# EAGLE design timer-board (EAGLE 9.6.1)
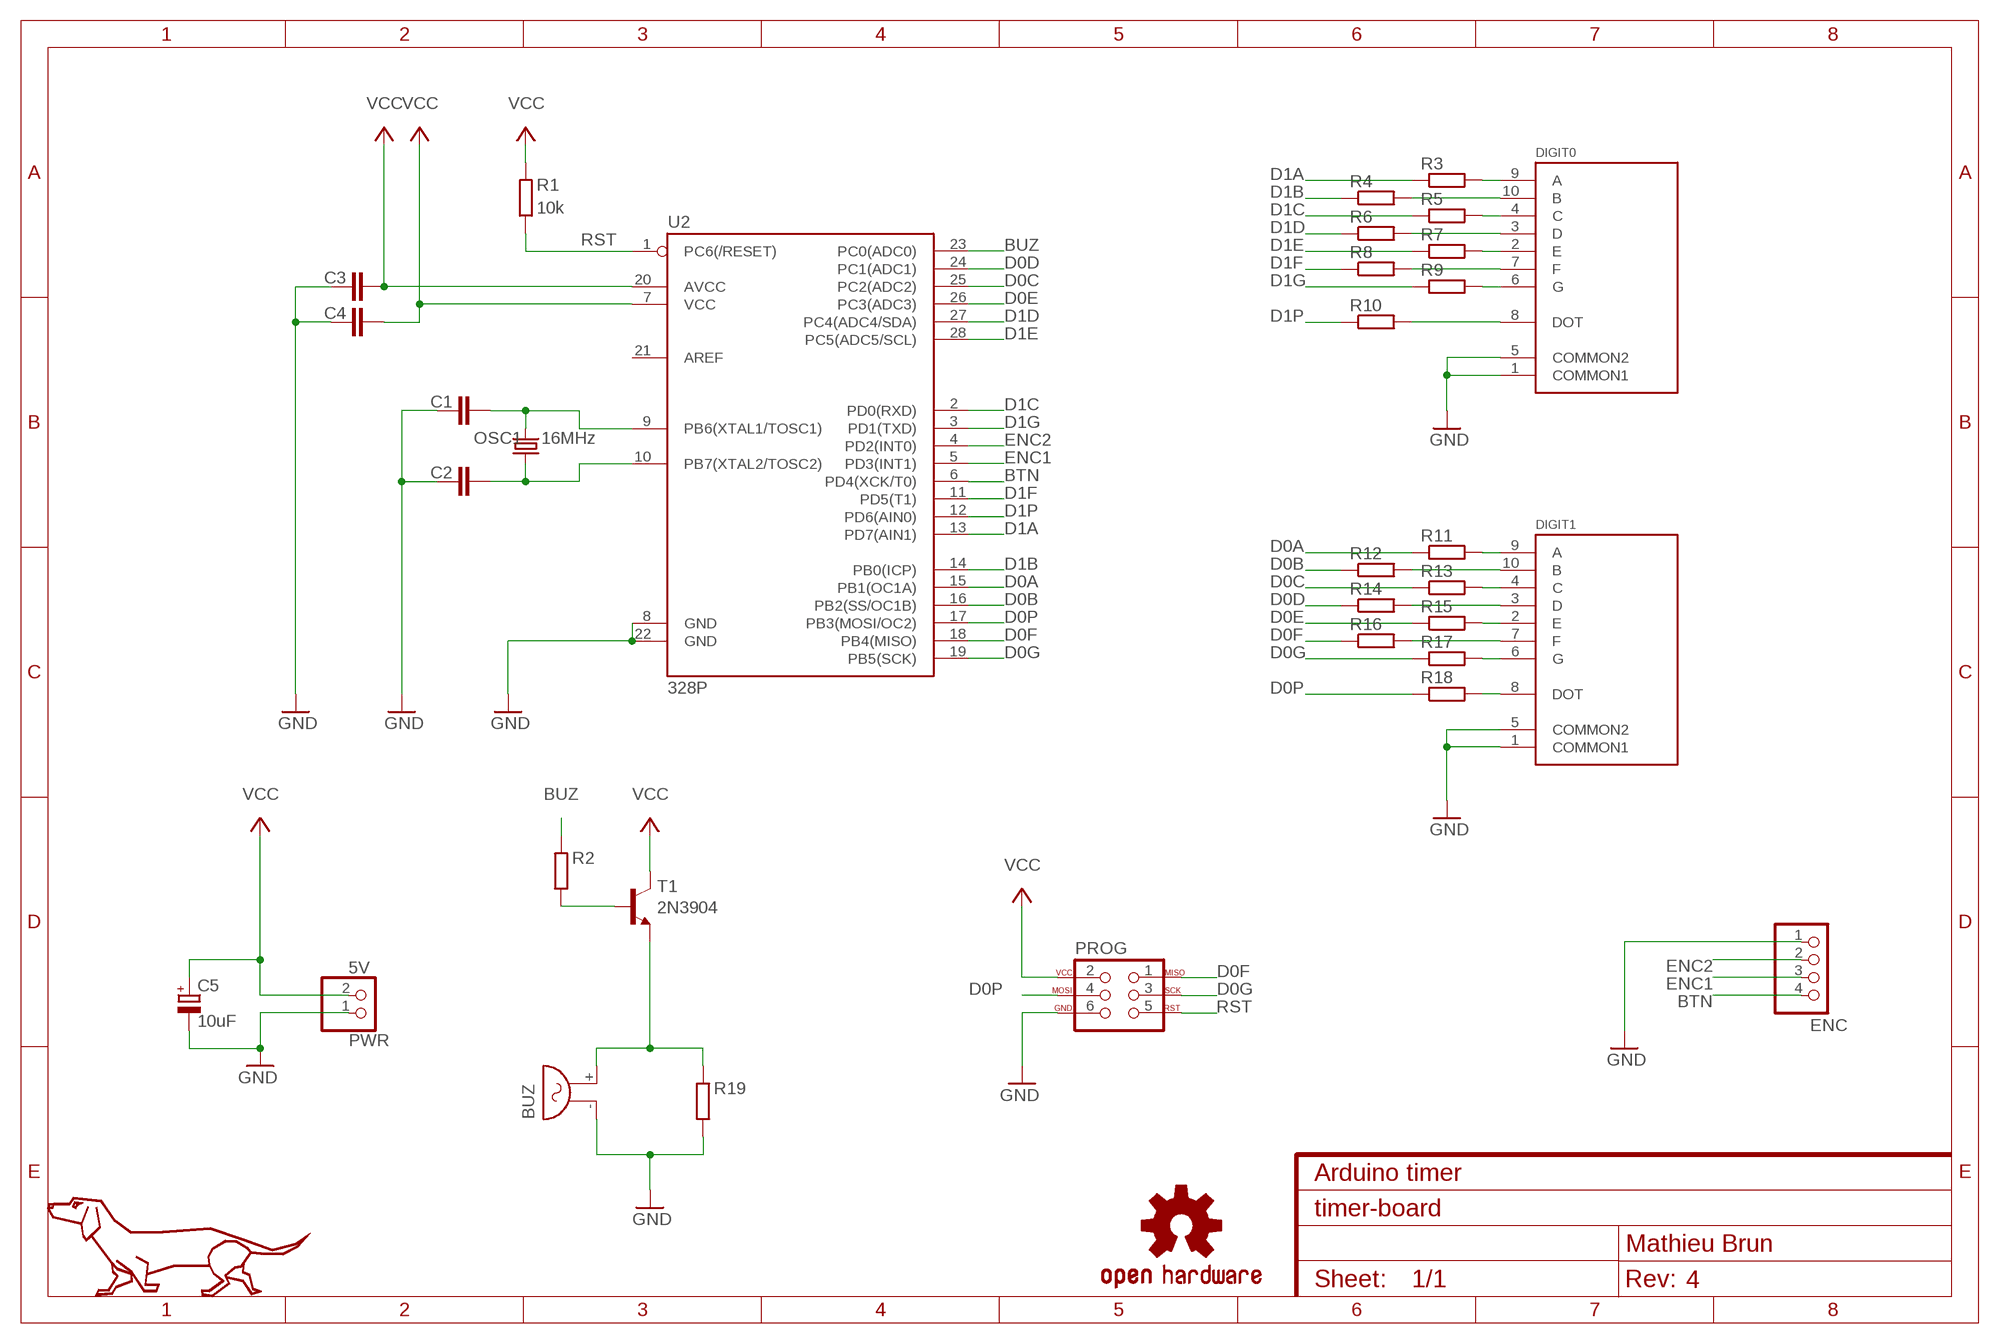
[diagram p0: schematic, sheet 1]
FRAME1 (FRAME-A4L): CNAME: Arduino timer; CREVISION: 4; DESIGNER: Mathieu Brun

## Parts
BUZ  BUZZER  [BUZZER]
C1  22pF  C-EU025-024X044  [C025-024X044]
C2  22pF  C-EU025-024X044  [C025-024X044]
C3  0.1uF  C-EU025-024X044  [C025-024X044]
C4  0.1uF  C-EU025-024X044  [C025-024X044]
C5  10uF  CPOL-EUE2.5-6  [E2,5-6]
DIGIT0  7_SEGMENT_DISPLAY  [7_SEGMENT_1.8_INCH]
DIGIT1  7_SEGMENT_DISPLAY  [7_SEGMENT_1.8_INCH]
ENC  CONN_1X5  CONN_1X4  [1X04_LOCK_JST]
LOGO1  OSHW-LOGOL  [OSHW-LOGO-L]
OSC1  16MHz  CRYSTAL-16MHZPTH-HC49US  [HC49US]
PROG  AVR_SPI_PROG_3X22X3_LOCK  [2X3_LOCK]
PWR  5V  CONN_1X2JST  [1X02_LOCK_JST]
R1  10k  R-EU_0207/10  [0207/10]
R2  R-EU_0207/10  [0207/10]
R3  R-EU_0207/10  [0207/10]
R4  R-EU_0207/10  [0207/10]
R5  R-EU_0207/10  [0207/10]
R6  R-EU_0207/10  [0207/10]
R7  R-EU_0207/10  [0207/10]
R8  R-EU_0207/10  [0207/10]
R9  R-EU_0207/10  [0207/10]
R10  R-EU_0207/10  [0207/10]
R11  R-EU_0207/10  [0207/10]
R12  R-EU_0207/10  [0207/10]
R13  R-EU_0207/10  [0207/10]
R14  R-EU_0207/10  [0207/10]
R15  R-EU_0207/10  [0207/10]
R16  R-EU_0207/10  [0207/10]
R17  R-EU_0207/10  [0207/10]
R18  R-EU_0207/10  [0207/10]
R19  R-EU_0207/10  [0207/10]
T1  2N3904  [TO92]
U2  328P  ATMEGA328P_PDIP  [DIP28]
U$1  LOGO_DOG  [LOGO_DOG]

## Nets
BTN: ENC.4 U2.6(PD4(XCK/T0))
BUZ: R2.2 U2.23(PC0(ADC0))
D0A: R11.1 U2.15(PB1(OC1A))
D0B: R12.1 U2.16(PB2(SS/OC1B))
D0C: R13.1 U2.25(PC2(ADC2))
D0D: R14.1 U2.24(PC1(ADC1))
D0E: R15.1 U2.26(PC3(ADC3))
D0F: PROG.1 R16.1 U2.18(PB4(MISO))
D0G: PROG.3 R17.1 U2.19(PB5(SCK))
D0P: PROG.4 R18.1 U2.17(PB3(MOSI/OC2))
D1A: R3.1 U2.13(PD7(AIN1))
D1B: R4.1 U2.14(PB0(ICP))
D1C: R5.1 U2.2(PD0(RXD))
D1D: R6.1 U2.27(PC4(ADC4/SDA))
D1E: R7.1 U2.28(PC5(ADC5/SCL))
D1F: R8.1 U2.11(PD5(T1))
D1G: R9.1 U2.3(PD1(TXD))
D1P: R10.1 U2.12(PD6(AIN0))
ENC1: ENC.3 U2.5(PD3(INT1))
ENC2: ENC.2 U2.4(PD2(INT0))
GND: BUZ.- C1.1 C2.1 C3.2 C4.2 C5.- DIGIT0.1(COMMON1) DIGIT0.5(COMMON2) DIGIT1.1(COMMON1) DIGIT1.5(COMMON2) ENC.1 PROG.6 PWR.1 R19.1 U2.8(GND) U2.22(GND)
N$1: DIGIT0.9(A) R3.2
N$2: DIGIT0.10(B) R4.2
N$3: DIGIT0.4(C) R5.2
N$4: DIGIT0.3(D) R6.2
N$5: DIGIT0.2(E) R7.2
N$6: DIGIT0.7(F) R8.2
N$7: DIGIT0.6(G) R9.2
N$9: DIGIT0.8(DOT) R10.2
N$10: R2.1 T1.2(B)
N$13: DIGIT1.9(A) R11.2
N$14: DIGIT1.10(B) R12.2
N$15: DIGIT1.4(C) R13.2
N$16: DIGIT1.3(D) R14.2
N$17: DIGIT1.2(E) R15.2
N$18: DIGIT1.7(F) R16.2
N$19: DIGIT1.6(G) R17.2
N$20: DIGIT1.8(DOT) R18.2
N$21: BUZ.+ R19.2 T1.3(E)
RST: PROG.5 R1.1 U2.1(PC6(/RESET))
VCC: C3.1 C4.1 C5.+ PROG.2 PWR.2 R1.2 T1.1(C) U2.7(VCC) U2.20(AVCC)
XTAL1: C1.2 OSC1.2 U2.9(PB6(XTAL1/TOSC1))
XTAL2: C2.2 OSC1.1 U2.10(PB7(XTAL2/TOSC2))
Unconnected: U2.21(AREF)

## Library data of the parts
BUZ = parts:BUZZER
C1-C4 = rcl:C-EU: CAPACITOR, European symbol; SPICEPREFIX: C
C5 = rcl:CPOL-EU: POLARIZED CAPACITOR, European symbol; SPICEPREFIX: C
DIGIT0 DIGIT1 = parts:7_SEGMENT_DISPLAY
ENC = parts:CONN_1X4
LOGO1 = SparkFun-Aesthetics:OSHW-LOGO: Open-Source Hardware (OSHW) Logo This logo indicates the piece of hardware it is found on incorporates a OSHW license and/or adheres to the definition of open source hardware found here: http://freedomdefined.org/OSHW
OSC1 = SparkFun-Clocks:CRYSTAL-16MHZ: 16MHz Crystal Digikey Example <http://www.digikey.com/product-search/en?keywords=535-9122-1-ND> Frequency: 16MHz Frequency Stability: ±50ppm Frequency Tolerance: ±20ppm Load Capacitance: 18pF SparkFun Products: Pro Micro -5V/16MHz <https://www.sparkfun.com/products/12640> SparkFun Serial Enabled LCD Kit <https://www.sparkfun.com/products/10097>; PROD_ID: XTAL-08181; SF_ID: COM-00536
PROG = SparkFun-Connectors:AVR_SPI_PROG_3X2: AVR ISP 6 Pin This is the reduced ISP connector for AVR programming. Common on Arduino. This footprint will take up less PCB space and can be used with a 10-pin to 6-pin adapter such as SKU: BOB-08508 **Special note about "TEST_POINT" package. The stop mask is on the top side, so if you want your programming test points to be on the bottom of your board, make sure to place this package on the bottom side of the board. This also ensure that the orientation to program from the bottom side will be correct. SparkFun Products: SparkFun ISP Pogo Adapter <https://www.sparkfun.com/products/11591> - NS Tiny AVR Programmer <https://www.sparkfun.com/products/11801> -PTH
PWR = parts:CONN_1X2
R1-R19 = rcl:R-EU_: RESISTOR, European symbol; SPICEPREFIX: R
T1 = transistor:2N3904: NPN TRANSISTOR
U2 = SparkFun-IC-Microcontroller:ATMEGA328P_PDIP: Atmel 328P Through hole ATMEGA328P uC used in the Arduino 32kb flash, 1k EEPROM, 2k SRAM Datasheet <http://www.sparkfun.com/datasheets/Components/SMD/ATMega328.pdf> SparkFun Products Storefront component: AVR 28 Pin 20MHz 32K 6A/D - ATMega328P <https://www.sparkfun.com/products/9061> (COM-09061) SparkFun Simon Says - Through-Hole Soldering Kit <https://www.sparkfun.com/products/10547> (KIT-10547) SparkFun Learn to Solder - Simon Says <https://www.sparkfun.com/products/13708> (KIT-13708) SparkFun BigTime Watch Kit <https://www.sparkfun.com/products/11734> (KIT-11734) SparkFun ClockIt <https://www.sparkfun.com/products/10930> (KIT-10930) SparkFun Serial Enabled LCD Kit <https://www.sparkfun.com/products/10097> (LCD-10097) SparkFun Simon Tilts - Through Hole Soldering Kit <https://www.sparkfun.com/products/12634> (KIT-12634) SparkFun Frequency Counter Kit <https://www.sparkfun.com/products/10140> (KIT-10140) FabFM Radio Kit <https://www.sparkfun.com/products/11043> (KIT-11043) SparkFun Binary Blaster Kit <https://www.sparkfun.com/products/12037> (KIT-12037) SparkFun Metro-Gnome <https://www.sparkfun.com/products/9236> (KIT-09236) ATmega328 with Arduino Optiboot (Uno) <https://www.sparkfun.com/products/10524> (DEV-10524); PROD_ID: IC-09136
U$1 = parts:LOGO_DOG

## Net classes
1 GND: width 0.203 mm

## Board
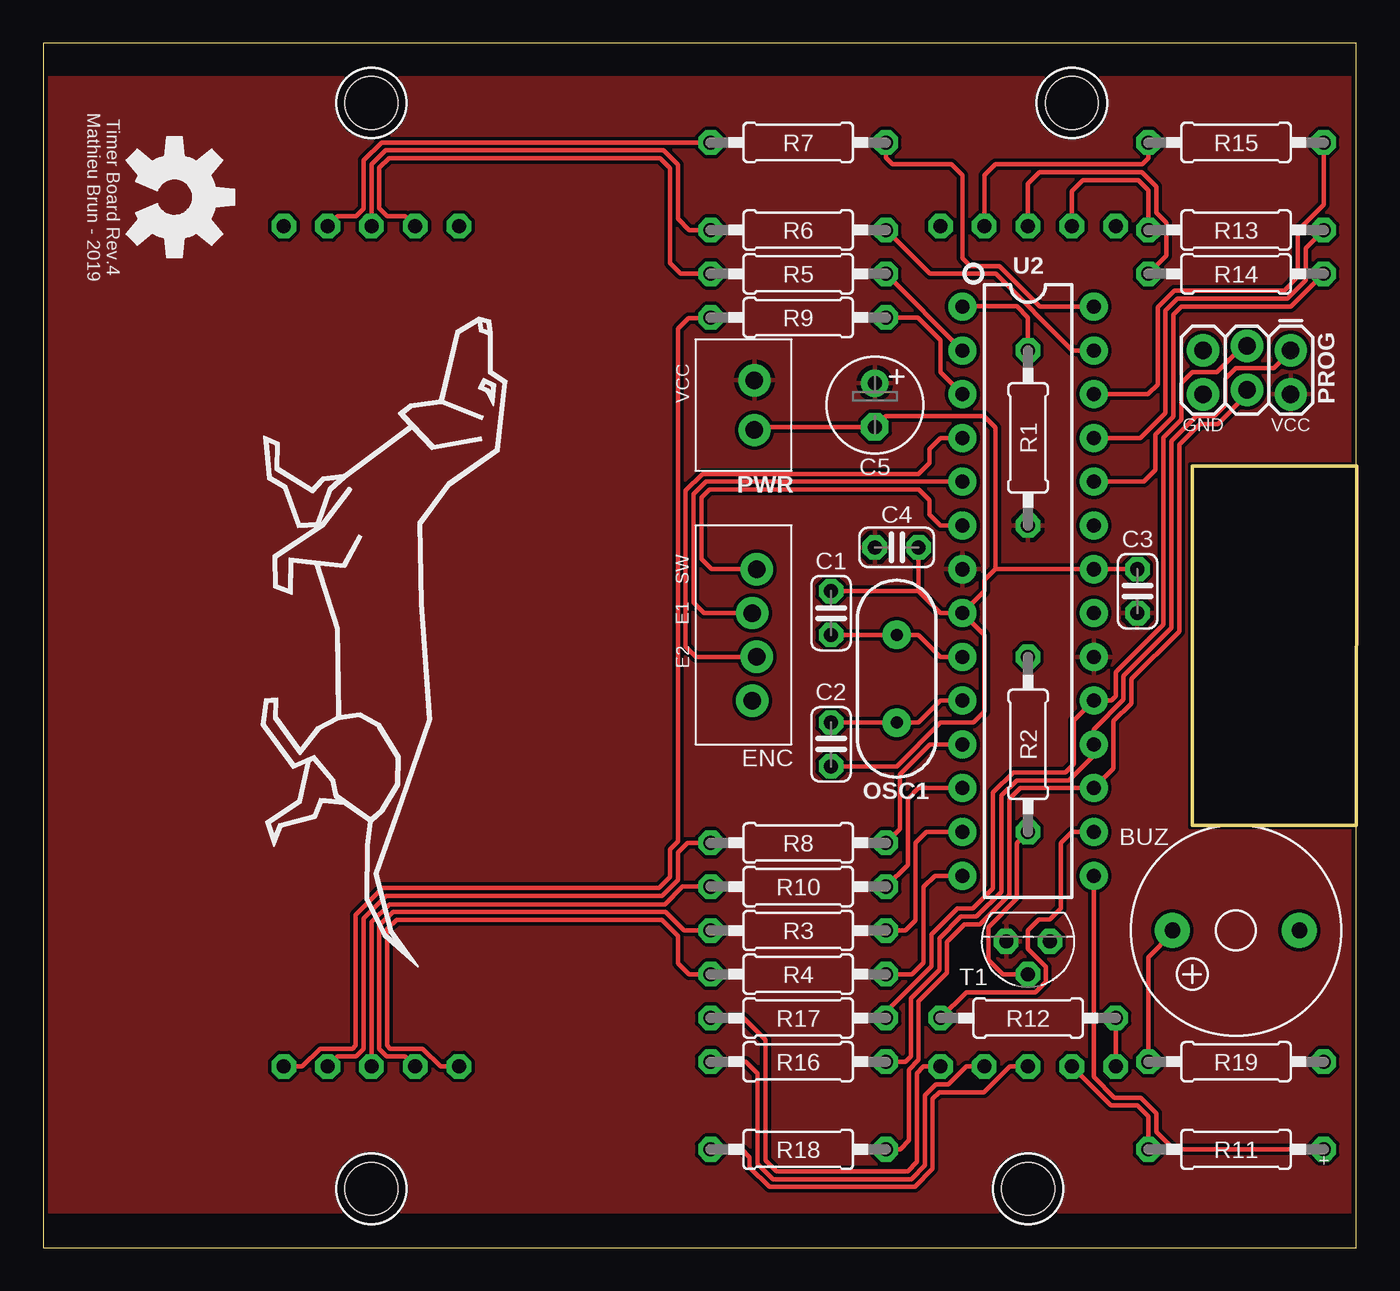
[diagram p1: board, top side]
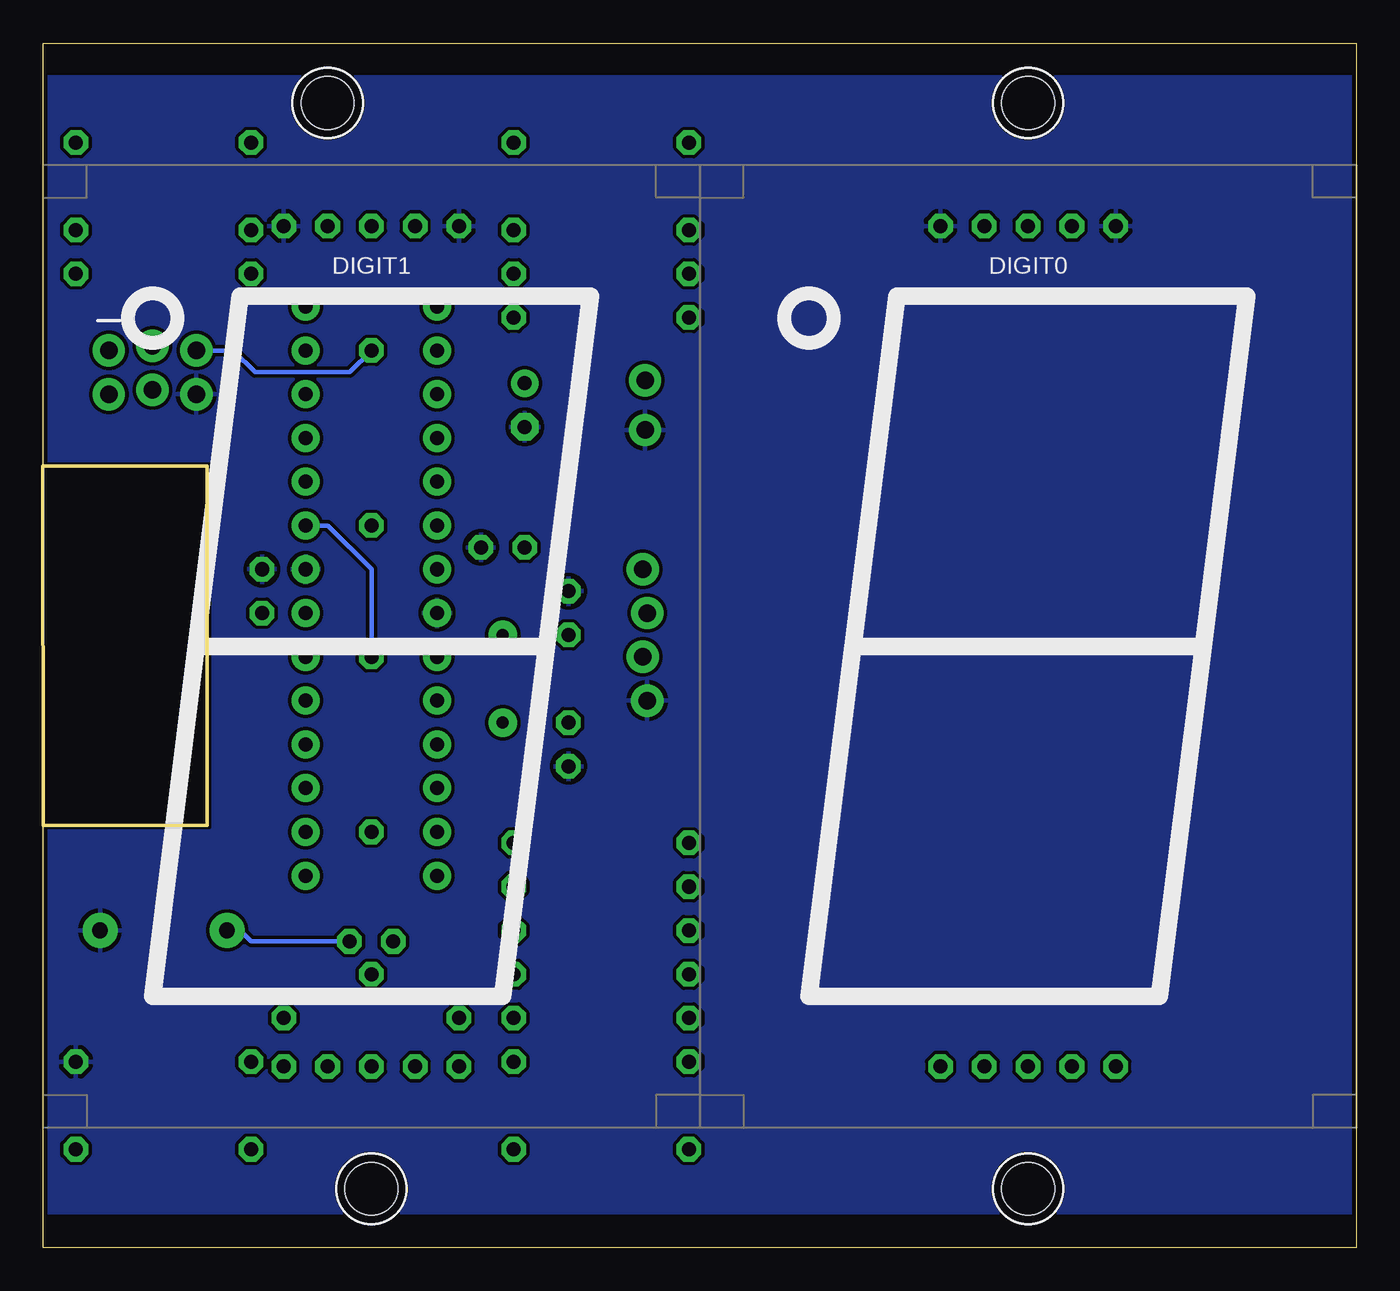
[diagram p2: board, bottom side, seen from below]

Size 76.2 x 69.9 mm. Coordinates in mm from the lower left corner, seen from the top.
Outline: 0,0 76.2,0 76.2,69.9 0,69.9 0,0
Copper layers (1*16): Top 0.035mm / dielectric 1.5mm / Bottom 0.035mm
Design rules "sparkfun": minimum track width 8mil, minimum drill 20mil, track to track 8mil, track to pad 8mil, pad to pad 8mil, via to via 8mil, smd to smd 8mil, copper to edge 10mil, drill to drill 8mil, minimum pad ring 12mil, minimum via ring 10mil, stop-mask expansion 4mil, vias tented up to drill 25mil, thermal gap 10mil
Holes 3.05 mm at 19.05,66.42 59.69,66.42 57.15,3.43 19.05,3.43
tRestrict: area 0,0 to 76.2,1.9; area 0,68.1 to 76.2,69.8; area 17,64.4 to 21.1,68.5; area 57.7,64.4 to 61.7,68.5; area 17,1.4 to 21.1,5.5; area 55.1,1.4 to 59.2,5.5; 4 lines
bRestrict: area 62.5,38.4 to 64.5,40.3; area 44.8,27 to 46.7,28.9; area 44.8,37.1 to 46.7,39.1; area 49.8,39.7 to 51.8,41.6; area 47.2,46.6 to 49.3,48.6; area 60,38.4 to 61.9,40.3; area 52.4,35.9 to 54.3,37.8; area 17,64.4 to 21.1,68.5; area 17,1.4 to 21.1,5.5; area 55.1,1.4 to 59.2,5.5; area 57.7,64.4 to 61.7,68.5; 4 lines
Milling: 4 lines

### Footprints (pad centres in the part's own frame; a part is rotated, then mirrored left to right if it is on the bottom)
BUZZER = drill 0.914 pad 2.032: + 3.683,0; - -3.683,0
C025-024X044 = drill 0.813 octagon: 1 -1.27,0; 2 1.27,0
E2,5-6 = drill 0.813 pad 1.6: + -1.27,0 | drill 0.813 pad 1.6 octagon: - 1.27,0
7_SEGMENT_1.8_INCH = drill 0.813 octagon: 1 -5.08,-24.384; 2 -2.54,-24.384; 3 0,-24.384; 4 2.54,-24.384; 5 5.08,-24.384; 6 -5.08,24.384; 7 -2.54,24.384; 8 0,24.384; 9 2.54,24.384; 10 5.08,24.384
1X04_LOCK_JST = drill 1.016 pad 1.88: 1 0,0.127; 2 2.54,-0.127; 3 5.08,0.127; 4 7.62,-0.127
HC49US = drill 0.7 pad 1.651: 1 -2.54,0; 2 2.54,0
2X3_LOCK = drill 1.016 pad 1.88: 1 0,0.127; 2 0,2.667; 3 2.54,-0.127; 4 2.54,2.413; 5 5.08,0.127; 6 5.08,2.667
1X02_LOCK_JST = drill 1.016 pad 1.88: 1 -0.178,0; 2 2.718,0
0207/10 = drill 0.813 octagon: 1 -5.08,0; 2 5.08,0
TO92 = drill 0.813 octagon: 1 1.27,0; 2 0,1.905; 3 -1.27,0
DIP28 = drill 0.813 pad 1.626: 1 -16.51,-3.81; 2 -13.97,-3.81; 3 -11.43,-3.81; 4 -8.89,-3.81; 5 -6.35,-3.81; 6 -3.81,-3.81; 7 -1.27,-3.81; 8 1.27,-3.81; 9 3.81,-3.81; 10 6.35,-3.81; 11 8.89,-3.81; 12 11.43,-3.81; 13 13.97,-3.81; 14 16.51,-3.81; 15 16.51,3.81; 16 13.97,3.81; 17 11.43,3.81; 18 8.89,3.81; 19 6.35,3.81; 20 3.81,3.81; 21 1.27,3.81; 22 -1.27,3.81; 23 -3.81,3.81; 24 -6.35,3.81; 25 -8.89,3.81; 26 -11.43,3.81; 27 -13.97,3.81; 28 -16.51,3.81

### Placement (x,y rotation side)
BUZ  69.22,18.41 180 top
C1  45.72,36.83 270 top
C2  45.72,29.21 90 top
C3  63.5,38.1 90 top
C4  49.53,40.64 0 top
C5  48.26,48.9 270 top
DIGIT0  19.05,34.9 180 bottom
DIGIT1  57.15,34.9 180 bottom
ENC  41.27,31.75 90 top
LOGO1  7.62,60.96 270 top
OSC1  49.53,33.02 90 top
PROG  72.39,52.2 180 top
PWR  41.27,47.62 90 top
R1  57.15,46.99 270 top
R2  57.15,29.21 90 top
R3  43.81,18.41 180 top
R4  43.81,15.88 180 top
R5  43.81,56.52 180 top
R6  43.81,59.05 180 top
R7  43.81,64.14 180 top
R8  43.81,23.5 180 top
R9  43.81,53.98 180 top
R10  43.81,20.95 180 top
R11  69.22,5.71 180 top
R12  57.15,13.34 0 top
R13  69.22,59.05 180 top
R14  69.22,56.52 180 top
R15  69.22,64.14 180 top
R16  43.81,10.79 180 top
R17  43.81,13.34 180 top
R18  43.81,5.71 180 top
R19  69.22,10.79 180 top
T1  57.15,17.78 180 top
U2  57.15,38.1 270 top
U$1  12.7,53.98 270 top

### Tracks (layer width: path | path; a pad name or v marks a point on that pad's centre or on a via)
BTN
  Top 0.254: ENC.4 38.79,39.37 38.2,39.95 38.2,43.54 38.66,43.99 50.83,43.99 51.44,43.38 51.44,42.55 52.07,41.91 U2.6
BUZ
  Bottom 0.254: R2.2 57.15,39.37 59.69,41.91 U2.23
D0A
  Top 0.254: R11.1 65.61,5.71 64.59,6.73 64.59,7.81 63.69,8.71 62.15,8.71 60.96,9.91 U2.15
D0B
  Top 0.254: R12.1 53.57,14.83 57.58,14.83 58.19,15.44 58.19,16.31 57.15,17.35 57.15,18.41 57.78,19.05 58.42,19.05 59.05,19.68 59.05,23.5 59.69,24.13 U2.16
D0C
  Top 0.254: U2.25 63.68,46.99 65.13,48.44 65.13,54.38 65.81,55.07 72.19,55.07 73.25,56.13 73.25,58.01 R13.1
D0D
  Top 0.254: U2.24 63.86,44.45 64.54,45.14 64.54,47.19 65.58,48.23 65.58,54.15 66.04,54.61 72.39,54.61 R14.1
D0E
  Top 0.254: U2.26 64.11,49.53 64.67,50.09 64.67,54.59 65.63,55.55 72.01,55.55 72.8,56.34 72.8,59.03 74.3,60.53 R15.1
D0F
  Top 0.254: R16.1 50.04,10.79 50.34,11.1 50.34,14.48 51.99,16.13 51.99,17.96 53.26,19.23 54.16,19.23 55.6,20.66 55.6,26.24 56.49,27.13 59.51,27.13 60.96,28.57 U2.18 60.96,30.08 62.69,31.81 62.69,33.19 65.46,35.95 65.46,46.81 66.9,48.26 67.94,48.26 68.58,48.9 68.58,50.44 69.2,51.05 71.39,51.05 72.39,52.05 PROG.1
D0G
  Top 0.254: R17.1 48.9,13.7 51.54,16.34 51.54,18.19 53.03,19.68 53.95,19.68 55.12,20.85 55.12,26.42 56.29,27.58 59.32,27.58 59.82,28.08 59.82,30.61 U2.19 61.98,31.75 62.23,32 62.23,33.4 65,36.17 65,47 66.04,48.04 66.04,50.16 66.67,50.8 68.1,50.8 69.62,52.32 PROG.3
D0P
  Top 0.254: R18.1 49.73,5.71 50.24,6.22 50.24,10.34 50.8,10.9 50.8,14.29 52.45,15.94 52.45,17.75 53.47,18.77 54.36,18.77 56.06,20.47 56.06,26.04 56.69,26.67 U2.17 62.1,27.81 62.1,30.56 63.14,31.6 63.14,33 65.91,35.77 65.91,46.61 67.11,47.8 68.15,47.8 69.85,49.51 PROG.4
D1A
  Top 0.254: R3.1 50.04,18.41 50.62,19 50.62,23.5 51.26,24.13 U2.13
D1B
  Top 0.254: R4.1 50.42,15.88 51.08,16.54 51.08,20.93 51.74,21.59 U2.14
D1C
  Top 0.254: R5.1 U2.2
D1D
  Top 0.254: U2.27 59.72,52.07 55.27,56.52 51.46,56.52 48.92,59.05 R6.1
D1E
  Top 0.254: R7.1 48.9,63.25 49.28,62.87 52.7,62.87 53.34,62.23 53.34,57.43 53.8,56.97 55.47,56.97 57.84,54.61 U2.28
D1F
  Top 0.254: R8.1 49.71,24.31 49.71,27.46 51.46,29.21 U2.11
D1G
  Top 0.254: U2.3 52.07,50.8 52.07,52.65 50.75,53.98 R9.1
D1P
  Top 0.254: R10.1 50.16,22.23 50.16,26.04 50.8,26.67 U2.12
ENC1
  Top 0.254: ENC.3 38.35,36.83 37.74,37.44 37.74,43.74 38.46,44.45 U2.5
ENC2
  Top 0.254: ENC.2 37.9,34.29 37.29,34.9 37.29,43.94 38.25,44.91 50.8,44.91 51.44,45.54 51.44,46.35 52.07,46.99 U2.4
GND
  Top 0.254: C2.1 49.53,27.94 52.07,30.48 53.98,30.48 54.61,31.11 54.61,35.56 U2.8 | PWR.1 41.45,47.62 C5.- 48.9,48.26 54.59,48.26 55.24,47.6 55.24,39.37 | U2.8 54.61,38.1 54.61,38.73 55.24,39.37 | C3.2 U2.22 55.24,39.37 | U2.8 52.07,36.83 50.8,38.1 | C1.1 50.8,38.1 | 50.8,38.1 C4.2
  pour Bottom: 0,67.94 0,2.03 76.2,2.03 76.2,67.94
N$1
  Top 0.254: DIGIT0.9 21.01,11.1 19.94,11.1 19.51,11.53 19.51,18.69 20.3,19.48 36.12,19.48 37.19,18.41 R3.2
N$2
  Top 0.254: DIGIT0.10 23.06,10.52 22.02,11.56 20.14,11.56 19.96,11.73 19.96,18.49 20.5,19.02 35.92,19.02 36.83,18.11 36.83,16.51 37.47,15.88 R4.2
N$3
  Top 0.254: R5.2 36.98,56.52 36.37,57.12 36.37,62.64 35.79,63.22 20.07,63.22 19.51,62.66 19.51,60.33 19.96,59.87 21.01,59.87 DIGIT0.4
N$4
  Top 0.254: R6.2 37.49,59.05 36.83,59.72 36.83,62.84 35.99,63.68 19.86,63.68 19.05,62.87 DIGIT0.3
N$5
  Top 0.254: DIGIT0.2 17.09,59.87 18.16,59.87 18.59,60.3 18.59,63.09 19.63,64.14 R7.2
N$6
  Top 0.254: DIGIT0.7 17.09,11.1 18.16,11.1 18.59,11.53 18.59,19.1 19.91,20.42 35.92,20.42 36.83,21.34 36.83,22.94 37.39,23.5 R8.2
N$7
  Top 0.254: DIGIT0.6 15.04,10.52 16.08,11.56 17.96,11.56 18.14,11.73 18.14,19.3 19.71,20.88 35.73,20.88 36.37,21.52 36.37,23.13 36.83,23.58 36.83,53.34 37.44,53.95 38.71,53.95 R9.2
N$9
  Top 0.254: DIGIT0.8 19.05,18.9 20.09,19.94 36.09,19.94 37.11,20.95 R10.2
N$10
  Top 0.254: R2.1 56.52,23.5 56.52,20.27 54.84,18.59 54.84,16.71 55.68,15.88 T1.2
N$13
  Top 0.254: DIGIT1.9 61.95,8.26 63.5,8.26 64.14,7.62 R11.2
N$14
  Top 0.254: R12.2 DIGIT1.10
N$15
  Top 0.254: R13.2 64.14,61.37 63.55,61.95 60.33,61.95 59.69,61.32 DIGIT1.4
N$16
  Top 0.254: DIGIT1.3 57.15,61.75 57.81,62.41 63.64,62.41 63.65,62.41 63.74,62.41 64.59,61.56 64.59,60.07 65.18,59.49 65.18,57.56 R14.2
N$17
  Top 0.254: R15.2 64.14,63.22 63.78,62.87 55.24,62.87 54.61,62.23 DIGIT1.2
N$18
  Top 0.254: DIGIT1.7 53.57,10.52 52.53,9.47 51.79,9.47 51.16,8.84 51.16,4.78 50.37,3.99 42.34,3.99 41.45,4.88 41.45,10.13 40.79,10.79 R16.2
N$19
  Top 0.254: DIGIT1.6 51.08,10.52 50.7,10.13 50.7,4.98 50.16,4.45 42.55,4.45 41.91,5.08 41.91,12.06 40.64,13.34 R17.2
N$20
  Top 0.254: DIGIT1.8 56.08,10.52 54.59,9.02 51.99,9.02 51.61,8.64 51.61,4.57 50.57,3.53 42.14,3.53 41,4.67 41,5.26 40.54,5.71 R18.2
N$21
  Top 0.254: R19.2 64.14,16.87 65.53,18.26 BUZ.+
  Bottom 0.254: T1.3 64.14,17.78 64.77,18.41 BUZ.+
RST
  Top 0.254: R1.1 57.15,53.98 56.49,54.63 53.37,54.63 U2.1
  Bottom 0.254: R1.1 58.42,50.8 63.91,50.8 65.18,52.07 PROG.5
VCC
  pour Top: 0,67.94 76.2,67.94 76.2,1.91 0,1.91
XTAL1
  Top 0.254: C1.2 OSC1.2 50.8,35.56 52.07,34.29 U2.9
XTAL2
  Top 0.254: U2.10 52.07,31.75 50.8,30.48 OSC1.1 C2.2

### Text on the board
tNames: Timer Board Rev.4 / Mathieu Brun - 2019 | VCC | GND | VCC | SW | E1 | E2 | +